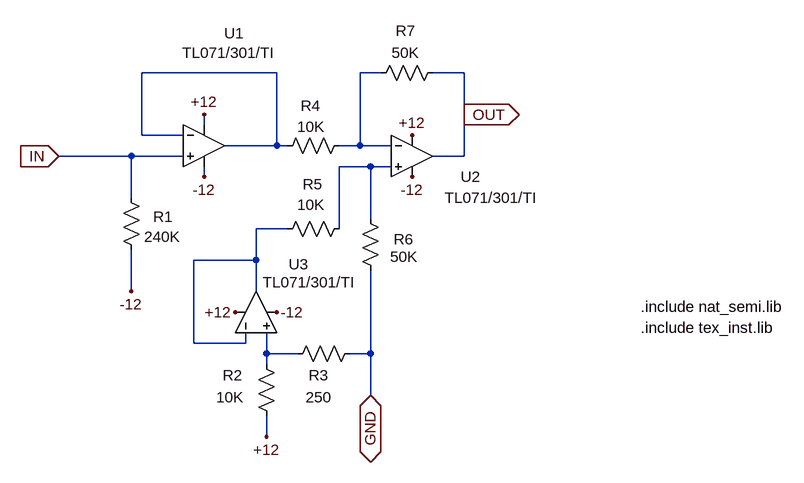
[diagram p0: schematic Component_1.asc]
Component_1.asc, the LTspice schematic file:
Version 4.1
SHEET 1 1044 700
WIRE 240 48 32 48
WIRE 400 48 368 48
WIRE 528 48 480 48
WIRE 528 112 528 48
WIRE 128 128 128 112
WIRE 32 144 32 48
WIRE 96 144 32 144
WIRE 240 160 240 48
WIRE 240 160 160 160
WIRE 256 160 240 160
WIRE 368 160 368 48
WIRE 368 160 336 160
WIRE 416 160 368 160
WIRE 16 176 -96 176
WIRE 96 176 16 176
WIRE 528 176 528 112
WIRE 528 176 480 176
WIRE 384 192 336 192
WIRE 416 192 384 192
WIRE 128 208 128 192
WIRE 16 240 16 176
WIRE 384 272 384 192
WIRE 256 288 208 288
WIRE 336 288 336 192
WIRE 208 336 208 288
WIRE 208 336 112 336
WIRE 16 384 16 320
WIRE 208 384 208 336
WIRE 112 464 112 336
WIRE 192 464 192 448
WIRE 192 464 112 464
WIRE 224 480 224 448
WIRE 272 480 224 480
WIRE 384 480 384 352
WIRE 384 480 352 480
WIRE 224 496 224 480
WIRE 384 544 384 480
WIRE 224 608 224 576
FLAG -96 176 IN
IOPIN -96 176 In
FLAG 384 544 GND
IOPIN 384 544 BiDir
FLAG 128 112 +12
FLAG 176 416 +12
FLAG 448 144 +12
FLAG 128 208 -12
FLAG 16 384 -12
FLAG 240 416 -12
FLAG 448 208 -12
FLAG 224 608 +12
FLAG 528 112 OUT
IOPIN 528 112 Out
SYMBOL Opamps\\opamp2 128 96 R0
WINDOW 0 31 -109 Left 2
WINDOW 3 -34 -79 Left 2
SYMATTR InstName U1
SYMATTR Value TL071/301/TI
SYMBOL Opamps\\opamp2 448 112 R0
WINDOW 0 75 96 Left 2
WINDOW 3 50 128 Left 2
SYMATTR InstName U2
SYMATTR Value TL071/301/TI
SYMBOL Opamps\\opamp2 144 416 R270
WINDOW 0 74 114 VRight 2
WINDOW 3 46 74 VRight 2
SYMATTR InstName U3
SYMATTR Value TL071/301/TI
SYMBOL res 0 224 R0
WINDOW 0 50 45 Left 2
SYMATTR InstName R1
SYMATTR Value 240K
SYMBOL res 208 480 R0
WINDOW 0 -51 33 Left 2
WINDOW 3 -61 67 Left 2
SYMATTR InstName R2
SYMATTR Value 10K
SYMBOL res 368 464 R90
WINDOW 0 65 64 VBottom 2
WINDOW 3 67 63 VTop 2
SYMATTR InstName R3
SYMATTR Value 250
SYMBOL res 352 144 R90
WINDOW 0 -30 60 VBottom 2
WINDOW 3 -29 59 VTop 2
SYMATTR InstName R4
SYMATTR Value 10K
SYMBOL res 352 272 R90
WINDOW 0 -37 57 VBottom 2
WINDOW 3 -37 59 VTop 2
SYMATTR InstName R5
SYMATTR Value 10K
SYMBOL res 368 256 R0
WINDOW 0 52 48 Left 2
WINDOW 3 46 75 Left 2
SYMATTR InstName R6
SYMATTR Value 50K
SYMBOL res 496 32 R90
WINDOW 0 -33 58 VBottom 2
WINDOW 3 -31 58 VTop 2
SYMATTR InstName R7
SYMATTR Value 50K
TEXT 800 408 Left 2 !.include nat_semi.lib
TEXT 800 440 Left 2 !.include tex_inst.lib

The netlist it stands for:
* Component_1.asc
X§U1 IN N001 +12 -12 N001 TL071/301/TI  ; pins In+ In- V+ V- OUT
X§U2 N003 N002 +12 -12 OUT TL071/301/TI  ; pins In+ In- V+ V- OUT
X§U3 N005 N004 +12 -12 N004 TL071/301/TI  ; pins In+ In- V+ V- OUT
R1 IN -12 240K
R2 N005 +12 10K
R3 GND N005 250
R4 N002 N001 10K
R5 N003 N004 10K
R6 N003 GND 50K
R7 OUT N002 50K
.include nat_semi.lib
.include tex_inst.lib
.backanno
.end